# Altium project Boost_Conv_V1.0.PrjPcb
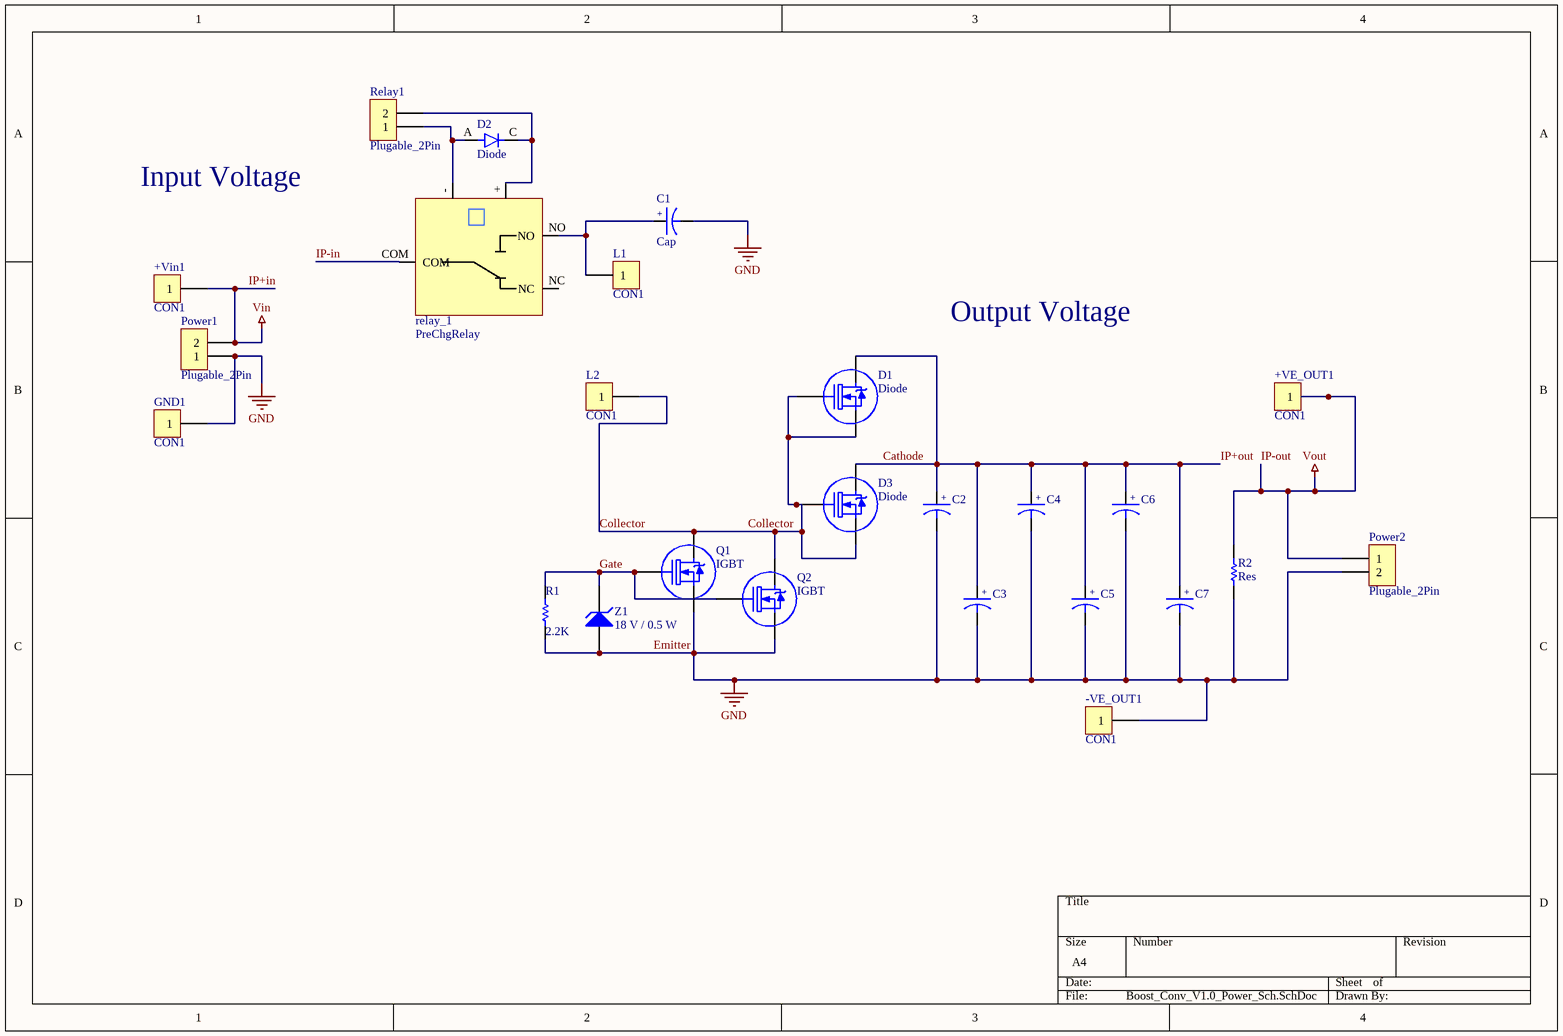
[diagram p0: Boost_Conv_V1.0_Power_Sch.SchDoc]
3 sheets, 53 parts. Net scope: global (net labels, ports and power ports of the same name join across sheets).
Board file: Boost_Conv_V1.0PCB.PcbDoc
Sheets:
  Boost_Conv_V1.0_Power_Sch.SchDoc
  Boost_Conv_V1.0_Control_Sch.SchDoc
  Boost_Conv_V1.0_Sensing_Sch.SchDoc

## Sheet Boost_Conv_V1.0_Power_Sch.SchDoc
size A4; SheetNumber: 1; SheetTotal: 3

### Parts
+VE_OUT1  CON1  [WIRE6MM]
+Vin1  CON1  [WIRE6MM]
-VE_OUT1  CON1  [WIRE6MM]
C1  Cap  [DC-CAPACITOR]
C2  Cap  [DC-CAPACITOR]  (value not drawn)
C3  Cap  [DC-CAPACITOR]  (value not drawn)
C4  Cap  [DC-CAPACITOR]  (value not drawn)
C5  Cap  [DC-CAPACITOR]  (value not drawn)
C6  Cap  [DC-CAPACITOR]  (value not drawn)
C7  Cap  [DC-CAPACITOR]  (value not drawn)
D1  Diode  [To220]
D2  Diode  [DIOAD1060W80L520D270]
D3  Diode  [To220]
GND1  CON1  [WIRE6MM]
L1  CON1  [WIRE6MM]
L2  CON1  [WIRE6MM]
Power1  Plugable_2Pin  [TB2]
Power2  Plugable_2Pin  [TB2]
Q1  IGBT  [TO247]
Q2  IGBT  [TO247]
R1  value 2.2K  [AXIAL-0.3]  (hidden comment: Res1)
R2  Res  [R600]
Relay1  Plugable_2Pin  [TB2]
relay_1  PreChgRelay  [NT90TNCS12CB]
Z1  18 V / 0.5 W  [D3]

### Nets
Emitter: -VE_OUT1.1 C1.2 C2.2 C3.2 C4.2 C5.2 C6.2 C7.2 GND1.1 Power1.1 Power2.2 Q1.3(S) Q2.3(S) R1.1 R2.1 Z1.A  [also labelled GND]
IP+in: +Vin1.1 Power1.2  [also labelled Vin]
IP-out: +VE_OUT1.1 Power2.1 R2.2  [also labelled Vout]
Cathode: C2.1 C3.1 C4.1 C5.1 C6.1 C7.1 D1.2(D) D3.2(D)  [also labelled IP+out]
Collector: D1.1(G) D1.3(S) D3.1(G) D3.3(S) L2.1 Q1.2(D) Q2.2(D)
Gate: Q1.1(G) Q2.1(G) R1.2 Z1.K  [project net G]
IP-in: relay_1.COM
NetC1_1: C1.1 L1.1 relay_1.NO
NetD2_A: D2.A Relay1.1 relay_1.-
NetD2_C: D2.C Relay1.2 relay_1.+

Not connected (* = marked no-connect by the designer): relay_1 NC

### Notes on the sheet
- Input Voltage
- Output Voltage
- (in symbol CAPACITOR POL) +

### Library data of the parts
+VE_OUT1 +Vin1 -VE_OUT1 GND1 L1 L2 = CON1: Connector; SMD/TH: TH
C1-C7 = CAPACITOR POL: Electrolytic Capacitors; SMD/TH: TH; DPM/VM/AM: DPM, VM, AM; Value: 820 uF / 450 V
D1 D3 = IRF540N: N-Channel MOSFET; Value: FEP16; Published: 8-Jun-2000; LatestRevisionDate: 17-Jul-2002; LatestRevisionNote: Re-released for DXP Platform.; PackageVersion: 1995/1996; PackageReference: E3; Publisher: Altium Limited; PackageDescription: TO, Flat Index; 3 In-Line, Axial Leads; Body Dia. 4.6mm; Lead Dia. 0.5 mm (max)
D2 = 1N4007RL: Diode Standard 1000 V 1A Through Hole Axial; MF: ON Semiconductor; Availability: In Stock; Purchase-URL: https://pricing.snapeda.com/search/part/1N4007RL/?ref=eda; Package: DO-41-2 ON Semiconductor; MP: 1N4007RL; Value: 1N4007RL; Check_prices: https://www.snapeda.com/parts/1N4007RL/Onsemi/view-part/?ref=eda; SnapEDA_Link: https://www.snapeda.com/parts/1N4007RL/Onsemi/view-part/?ref=snap; Price: None
Power1 Power2 Relay1 = CON2: Connector; SMD/TH: TH
Q1 Q2 = IRF540N: N-Channel MOSFET; Value: IRGP4066; Published: 8-Jun-2000; LatestRevisionDate: 17-Jul-2002; LatestRevisionNote: Re-released for DXP Platform.; PackageVersion: 1995/1996; PackageReference: E3; Publisher: Altium Limited; PackageDescription: TO, Flat Index; 3 In-Line, Axial Leads; Body Dia. 4.6mm; Lead Dia. 0.5 mm (max)
R1 = Res1: Resistor; Published: 8-Jun-2000; LatestRevisionDate: 17-Jul-2002; LatestRevisionNote: Re-released for DXP Platform.; PackageReference: AXIAL-0.3; Publisher: Altium Limited; PackageDescription: Axial Device, Thru-Hole; 2 Leads; 0.3 in Pin Spacing
R2 = Res1: Resistor; SMD/TH: SMD; Value: 10k/0.5w
relay_1 = PreChgRelay: NT90THLCE12CB; Value: NT90THLCE12CB
Z1 = Zener_Diode: Zener diode; SMD/TH: SMD

## Sheet Boost_Conv_V1.0_Control_Sch.SchDoc
size A; SheetNumber: 2; SheetTotal: 3
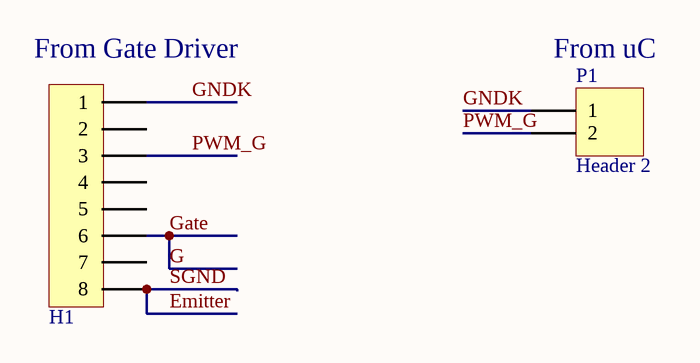
[diagram p1: Boost_Conv_V1.0_Control_Sch.SchDoc]

### Parts
H1  H2*8  [HDR2X8]  (value not drawn)
P1  Header 2  [HDR1X2]

### Nets
Emitter: H1.8  [also labelled SGND]
G: H1.6  [also labelled Gate]
GNDK: H1.1 P1.1
PWM_G: H1.3 P1.2

Not connected (* = marked no-connect by the designer): H1 2 4 5 7

### Notes on the sheet
- (near H1) From Gate Driver
- (near P1) From uC

### Library data of the parts
H1 = Header 8X2
P1 = Header 2: Header, 2-Pin; LatestRevisionDate: 17-Jul-2002; LatestRevisionNote: Re-released for DXP Platform.; Publisher: Altium Limited

## Sheet Boost_Conv_V1.0_Sensing_Sch.SchDoc
size A; SheetNumber: 3; SheetTotal: 3
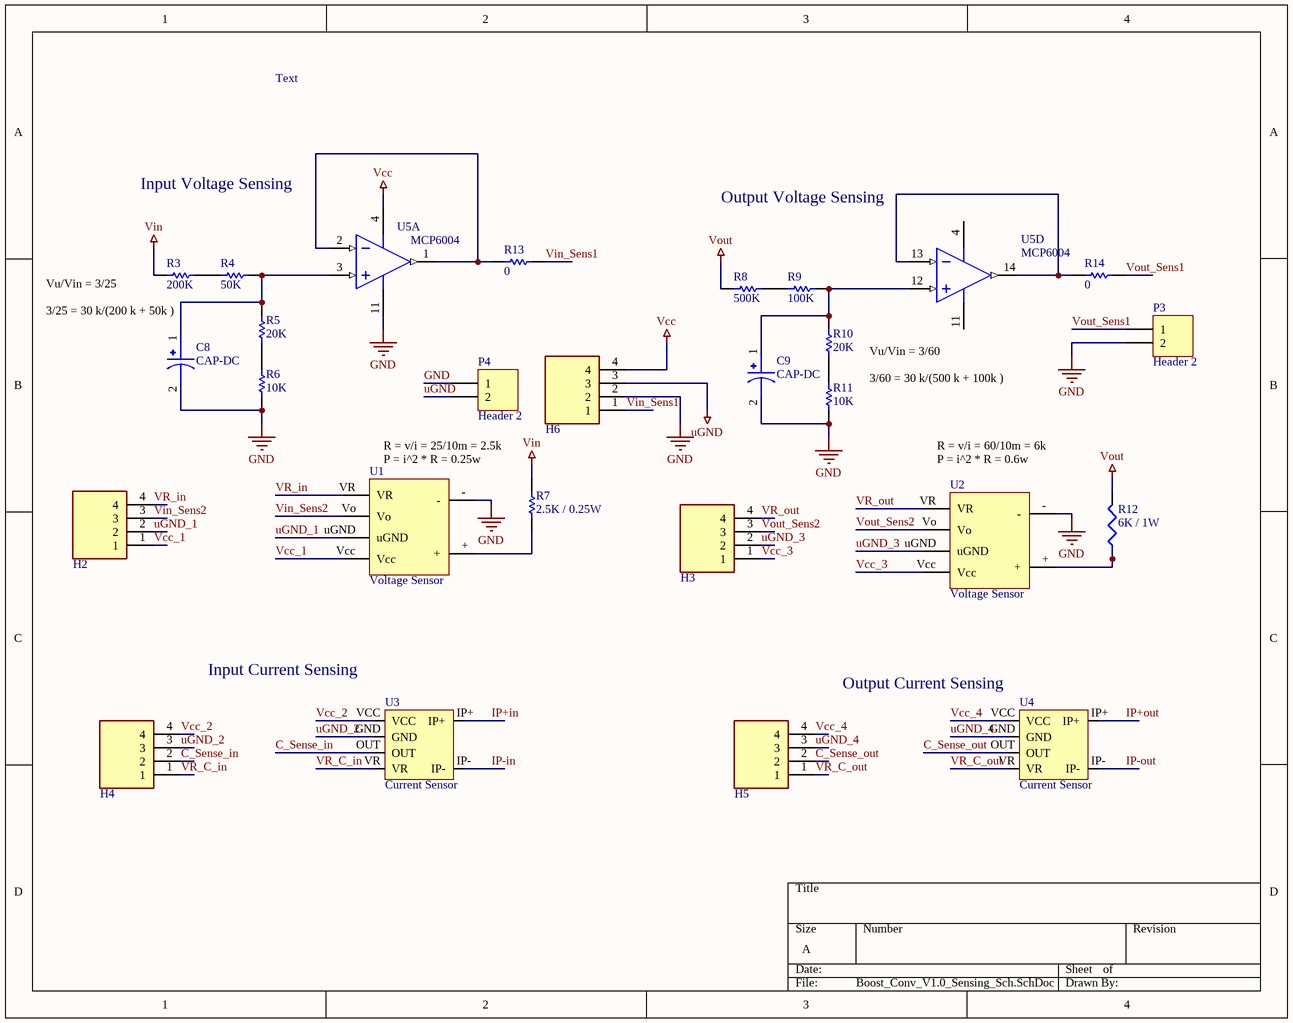
[diagram p2: Boost_Conv_V1.0_Sensing_Sch.SchDoc]

### Parts
C8  CAP-DC  [CAP-1.5]
C9  CAP-DC  [CAP-1.5]
H2  pin header 4p  [SIP4]  (value not drawn)
H3  pin header 4p  [SIP4]  (value not drawn)
H4  pin header 4p  [SIP4]  (value not drawn)
H5  pin header 4p  [SIP4]  (value not drawn)
H6  pin header 4p  [SIP4]  (value not drawn)
P3  Header 2  [HDR1X2]
P4  Header 2  [HDR1X2]
R3  value 200K  [AXIAL-0.3]  (hidden comment: Res1)
R4  value 50K  [AXIAL-0.3]  (hidden comment: Res1)
R5  value 20K  [AXIAL-0.3]  (hidden comment: Res1)
R6  value 10K  [AXIAL-0.3]  (hidden comment: Res1)
R7  2.5K / 0.25W  [R600]
R8  value 500K  [AXIAL-0.3]  (hidden comment: Res1)
R9  value 100K  [AXIAL-0.3]  (hidden comment: Res1)
R10  value 20K  [AXIAL-0.3]  (hidden comment: Res1)
R11  value 10K  [AXIAL-0.3]  (hidden comment: Res1)
R12  6K / 1W  [R-VSENSE]
R13  value 0  [AXIAL-0.3]  (hidden comment: Res1)
R14  value 0  [AXIAL-0.3]  (hidden comment: Res1)
U1  Voltage Sensor  [VSENSE]
U2  Voltage Sensor  [VSENSE]
U3  Current Sensor  [JCT-TSRNP]
U4  Current Sensor  [JCT-TSRNP]
U5  MCP6004  [DIP14]  (parts A,D of 4)

### Nets
GND: C8.2 C9.2 H6.2 P3.2 P4.1 R6.1 R11.1 U1.- U2.- U5.11(VEE)  [project net Emitter]
IP+in: R3.2 R7.2 U3.IP+  [also labelled Vin]
IP-out: R8.2 R12.2 U4.IP-  [also labelled Vout]
uGND: H6.3 P4.2
Vcc: H6.4 U5.4(VCC)
C_Sense_in: H4.2 U3.OUT
C_Sense_out: H5.2 U4.OUT
IP+out: U4.IP+  [project net Cathode]
IP-in: U3.IP-
uGND_1: H2.2 U1.uGND
uGND_2: H4.3 U3.GND
uGND_3: H3.2 U2.uGND
uGND_4: H5.3 U4.GND
Vcc_1: H2.1 U1.Vcc
Vcc_2: H4.4 U3.VCC
Vcc_3: H3.1 U2.Vcc
Vcc_4: H5.4 U4.VCC
Vin_Sens1: H6.1 R13.1
Vin_Sens2: H2.3 U1.Vo
Vout_Sens1: P3.1 R14.1
Vout_Sens2: H3.3 U2.Vo
VR_C_in: H4.1 U3.VR
VR_C_out: H5.1 U4.VR
VR_in: H2.4 U1.VR
VR_out: H3.4 U2.VR
NetC8_1: C8.1 R4.1 R5.2 U5.3(1_IN+)
NetC9_1: C9.1 R9.1 R10.2 U5.12(4_IN+)
NetR3_1: R3.1 R4.2
NetR5_1: R5.1 R6.2
NetR7_1: R7.1 U1.+
NetR8_1: R8.1 R9.2
NetR10_1: R10.1 R11.2
NetR12_1: R12.1 U2.+
NetR13_2: R13.2 U5.1(1_OUT) U5.2(1_IN-)
NetR14_2: R14.2 U5.13(4_IN-) U5.14(4_OUT)

### Notes on the sheet
- Text
- Input Voltage Sensing
- (near U5) Output Voltage Sensing
- (near R3) Vu/Vin = 3/25
  3/25 = 30 k/(200 k + 50k )
- Vu/Vin = 3/60
  3/60 = 30 k/(500 k + 100k )
- R = v/i = 25/10m = 2.5k
  P = i^2 * R = 0.25w
- R = v/i = 60/10m = 6k
  P = i^2 * R = 0.6w
- (near U3) Input Current Sensing
- (near U4) Output Current Sensing

### Library data of the parts
H2-H6 = pin header 4p: Manufacturer: TE Connectivity AMP; Manufacturer Part Number: 2355186-4; Supplier 1: Digi-Key; Supplier Part Number 1: 17-2355186-4-ND; Stock 1: 5950; Pricing 1: 1=0.84, 10=0.708, 100=0.6356, 500=0.52, 1000=0.46222, 5000=0.40444, 10000=0.38518 (USD)
P3 P4 = Header 2: Header, 2-Pin; LatestRevisionDate: 17-Jul-2002; LatestRevisionNote: Re-released for DXP Platform.; Publisher: Altium Limited
R3-R6 R8-R11 R13 R14 = Res1: Resistor; Published: 8-Jun-2000; LatestRevisionDate: 17-Jul-2002; LatestRevisionNote: Re-released for DXP Platform.; PackageReference: AXIAL-0.3; Publisher: Altium Limited; PackageDescription: Axial Device, Thru-Hole; 2 Leads; 0.3 in Pin Spacing
R7 = Res1: Resistor; SMD/TH: SMD
R12 = R-VSENSE
U1 U2 = Vsense-JCT-L25P3.3: JCT-L25P3.3-voltage sensor; Value: JCT-L25P3.3
U3 U4 = JCT-TSRNP: JCT-TSRNP3.3; Value: JCT-TSRNP3.3
U5 = MCP6004: Low Power Quad Operational Amplifier; note: SC; SMD/TH: SMD

## Nets that join several sheets
Emitter: Boost_Conv_V1.0_Power_Sch (16 pins), Boost_Conv_V1.0_Control_Sch (H1.8), Boost_Conv_V1.0_Sensing_Sch (10 pins)
IP+in: Boost_Conv_V1.0_Power_Sch (+Vin1.1 Power1.2), Boost_Conv_V1.0_Sensing_Sch (R3.2 R7.2 U3.IP+)
IP-out: Boost_Conv_V1.0_Power_Sch (+VE_OUT1.1 Power2.1 R2.2), Boost_Conv_V1.0_Sensing_Sch (R8.2 R12.2 U4.IP-)
Cathode: Boost_Conv_V1.0_Power_Sch (8 pins), Boost_Conv_V1.0_Sensing_Sch (U4.IP+)
G: Boost_Conv_V1.0_Power_Sch (Q1.1 Q2.1 R1.2 Z1.K), Boost_Conv_V1.0_Control_Sch (H1.6)
IP-in: Boost_Conv_V1.0_Power_Sch (relay_1.COM), Boost_Conv_V1.0_Sensing_Sch (U3.IP-)